# Altium schematic sheet 车门车灯子系统.SchDoc
size A4
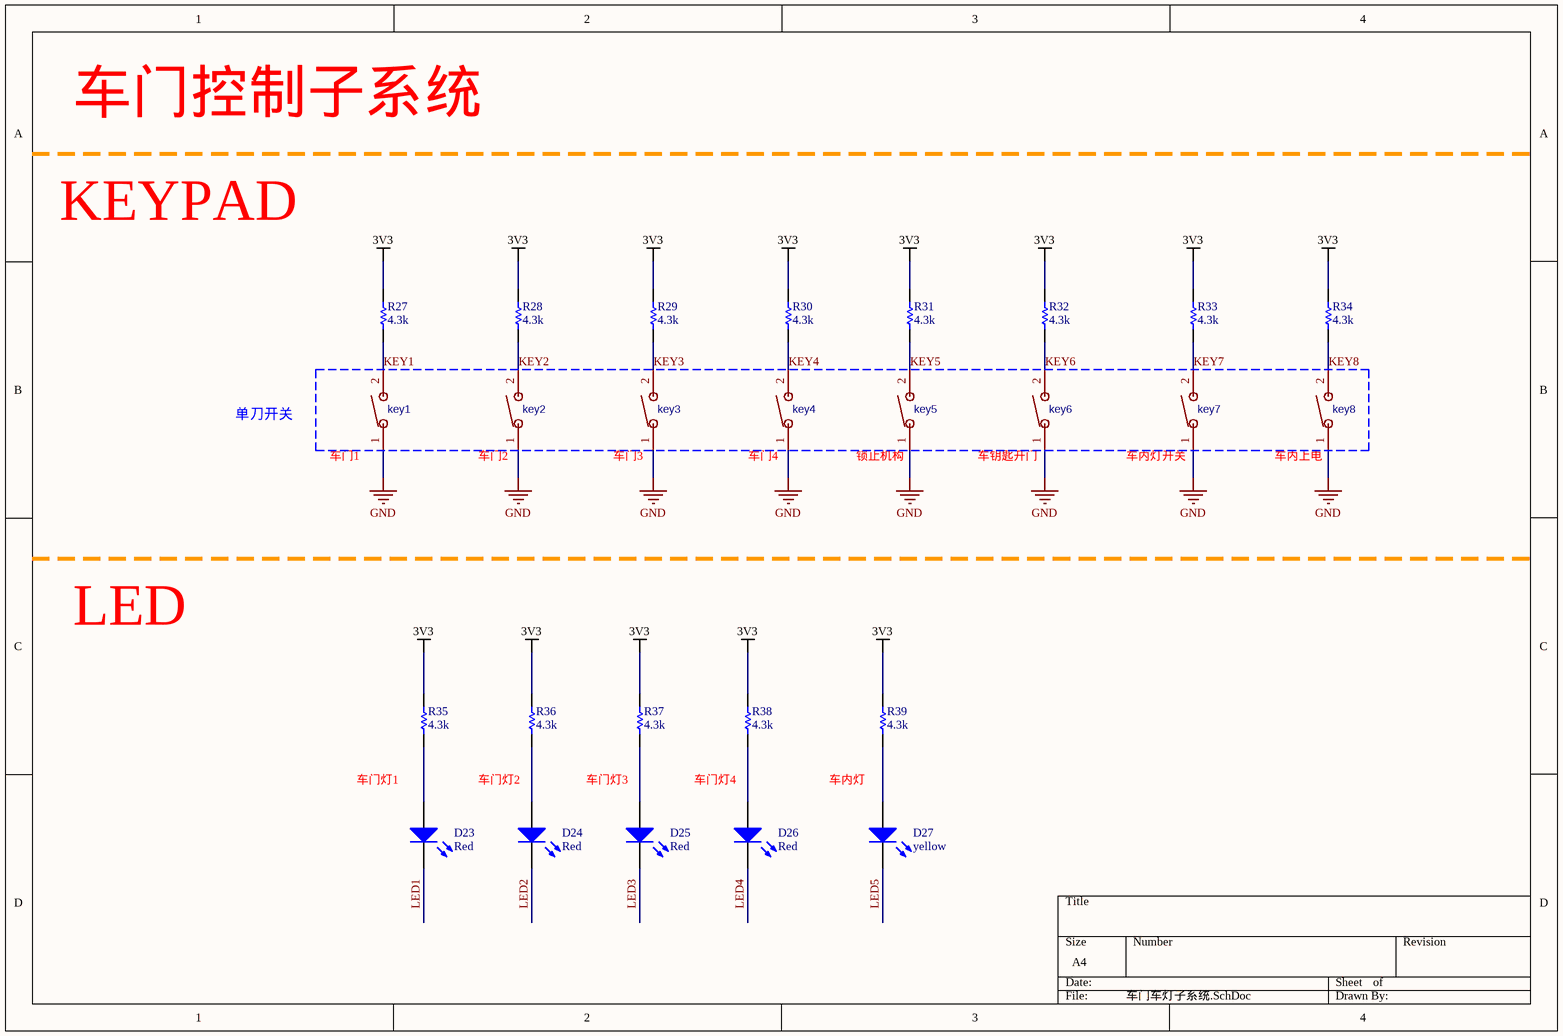
[diagram p0: 车门车灯子系统.SchDoc]

## Parts
D23  value Red  [LED-TH_L5.0-W2.7-FD]  (hidden comment: LED)
D24  value Red  [LED-TH_L5.0-W2.7-FD]  (hidden comment: LED)
D25  value Red  [LED-TH_L5.0-W2.7-FD]  (hidden comment: LED)
D26  value Red  [LED-TH_L5.0-W2.7-FD]  (hidden comment: LED)
D27  value yellow  [LED-TH_L5.0-W2.7-FD]  (hidden comment: LED)
key1  TSA343G00-250J2  [SW-TH_DEALON_MS-12D19-G2]  (value not drawn)
key2  TSA343G00-250J2  [SW-TH_DEALON_MS-12D19-G2]  (value not drawn)
key3  TSA343G00-250J2  [SW-TH_DEALON_MS-12D19-G2]  (value not drawn)
key4  TSA343G00-250J2  [SW-TH_DEALON_MS-12D19-G2]  (value not drawn)
key5  TSA343G00-250J2  [SW-TH_DEALON_MS-12D19-G2]  (value not drawn)
key6  TSA343G00-250J2  [SW-TH_DEALON_MS-12D19-G2]  (value not drawn)
key7  TSA343G00-250J2  [SW-TH_DEALON_MS-12D19-G2]  (value not drawn)
key8  TSA343G00-250J2  [SW-TH_DEALON_MS-12D19-G2]  (value not drawn)
R27  value 4.3k  [0402_R]  (hidden comment: Res_5%)
R28  value 4.3k  [0402_R]  (hidden comment: Res_5%)
R29  value 4.3k  [0402_R]  (hidden comment: Res_5%)
R30  value 4.3k  [0402_R]  (hidden comment: Res_5%)
R31  value 4.3k  [0402_R]  (hidden comment: Res_5%)
R32  value 4.3k  [0402_R]  (hidden comment: Res_5%)
R33  value 4.3k  [0402_R]  (hidden comment: Res_5%)
R34  value 4.3k  [0402_R]  (hidden comment: Res_5%)
R35  value 4.3k  [0402_R]  (hidden comment: Res_5%)
R36  value 4.3k  [0402_R]  (hidden comment: Res_5%)
R37  value 4.3k  [0402_R]  (hidden comment: Res_5%)
R38  value 4.3k  [0402_R]  (hidden comment: Res_5%)
R39  value 4.3k  [0402_R]  (hidden comment: Res_5%)

## Nets
3V3: R27.2 R28.2 R29.2 R30.2 R31.2 R32.2 R33.2 R34.2 R35.2 R36.2 R37.2 R38.2 R39.2
GND: key1.1 key2.1 key3.1 key4.1 key5.1 key6.1 key7.1 key8.1
KEY1: key1.2 R27.1
KEY2: key2.2 R28.1
KEY3: key3.2 R29.1
KEY4: key4.2 R30.1
KEY5: key5.2 R31.1
KEY6: key6.2 R32.1
KEY7: key7.2 R33.1
KEY8: key8.2 R34.1
LED1: D23.2(K)
LED2: D24.2(K)
LED3: D25.2(K)
LED4: D26.2(K)
LED5: D27.2(K)
NetD23_1: D23.1(A) R35.1
NetD24_1: D24.1(A) R36.1
NetD25_1: D25.1(A) R37.1
NetD26_1: D26.1(A) R38.1
NetD27_1: D27.1(A) R39.1

## Notes on the sheet
- 车门控制子系统
- KEYPAD
- 单刀开关
- (near key1) 车门1
- (near key2) 车门2
- (near key3) 车门3
- (near key4) 车门4
- (near key5) 锁止机构
- 车钥匙开门
- (near key7) 车内灯开关
- (near key8) 车内上电
- LED
- 车门灯1
- 车门灯2
- 车门灯3
- 车门灯4
- 车内灯

## Library data of the parts
D23-D27 = T_LED_Red_0805: 红色LED灯; Solder: SMD; Schematic Path: X:\Database\Schematic Library.Schlib; Part Number: T_LED_Red_0805; LibRef: T_LED_Red_0805
key1-key8 = TSA343G00-250J2: BOM_Manufacturer: BRIGHT; Contributor: LCSC; BOM_Supplier: LCSC; BOM_Supplier Part: C354946; BOM_Manufacturer Part: TSA343G00-250J2; BOM_JLCPCB Part Class: Extended Part; spicePre: S; spiceSymbolName: TSA343G00-250J2
R27-R39 = T_Res_0603_4.3k_5%_1/10W: 贴片电阻; Solder: SMD; Power: 1/10W; Tolerance: 5%; Schematic Path: X:\Database\Schematic Library.Schlib; Part Number: T_Res_0603_4.3k_5%_1/10W; LibRef: T_Res_0603_4.3k_5%_1/10W